# Altium schematic sheet main.SchDoc
size 420 x 297 mm
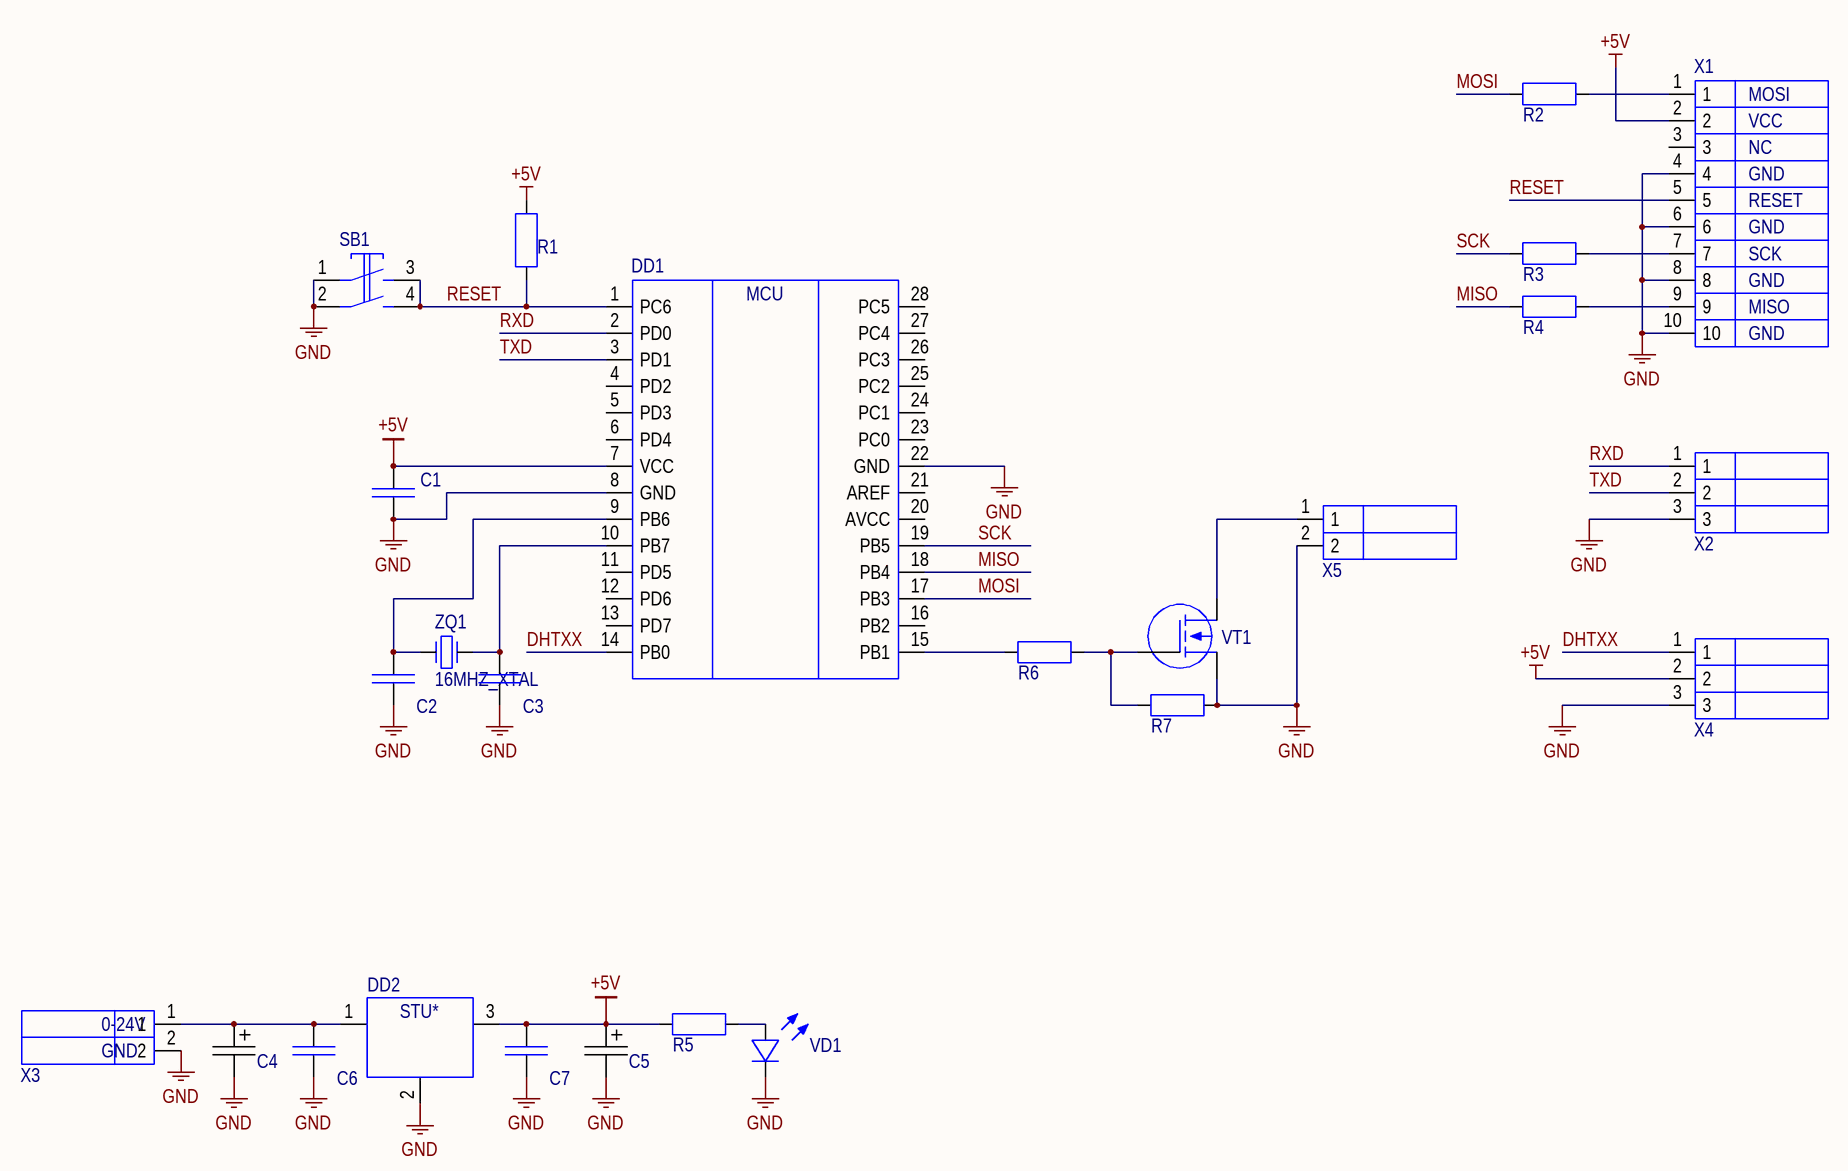
[diagram p0: main.SchDoc]

## Parts
C1  100P50V_CAPRR  [CAPRR500W50L400T260H400]  (value not drawn)
C2  30P50V_CAPRR  [CAPRR500W50L400T260H400]  (value not drawn)
C3  30P50V_CAPRR  [CAPRR500W50L400T260H400]  (value not drawn)
C4  100U16V_CAPAE  [CAPAE500X1100]  (value not drawn)
C5  47U16V_CAPAE  [CAPAE500X1100]  (value not drawn)
C6  100P50V_CAPRR  [CAPRR500W50L400T260H400]  (value not drawn)
C7  100P50V_CAPRR  [CAPRR500W50L400T260H400]  (value not drawn)
DD1  ATMEGA8  [PDIP28]  (value not drawn)
DD2  L7805ABV  [TO-220]  (value not drawn)
R1  CF14JT10K0  [RESAD800W55L600D230]  (value not drawn)
R2  CF14JT220R0  [RESAD800W55L600D230]  (value not drawn)
R3  CF14JT220R0  [RESAD800W55L600D230]  (value not drawn)
R4  CF14JT220R0  [RESAD800W55L600D230]  (value not drawn)
R5  CF14JT220R0  [RESAD800W55L600D230]  (value not drawn)
R6  CF14JT100R  [RESAD800W55L600D230]  (value not drawn)
R7  CF14JT10K0  [RESAD800W55L600D230]  (value not drawn)
SB1  BTN_TACTILE_6X6  [BTN_TACTILE_6X6]  (value not drawn)
VD1  LED_SSL-LX5093GD-TR26  [LED500]  (value not drawn)
VT1  IRF730  [TO-220-1]  (value not drawn)
X1  ISP  [302_SERIES_10POS]  (value not drawn)
X2  61300311121  [PLS_3]  (value not drawn)
X3  PJ-037BH  [PJ-037BH]  (value not drawn)
X4  61300311121  [PLS_3]  (value not drawn)
X5  SCREW3N2  [SCREW3N2]  (value not drawn)
ZQ1  16MHZ_XTAL  [XTAL1050X465X350]

## Nets
+5V: C1.2 C5.1 C7.2 DD1.7(VCC) DD2.3(OUT) R1.2 R5.2 X1.2 X4.2
GND: C1.1 C2.1 C3.1 C4.2 C5.2 C6.1 C7.1 DD1.8(GND) DD1.22(GND) DD2.2(GND) R7.2 SB1.1 SB1.2 VD1.K VT1.3 X1.4 X1.6 X1.8 X1.10 X2.3 X3.2 X4.3 X5.2
DHTXX: DD1.14(PB0) X4.1
MISO: DD1.18(PB4) R4.1
MOSI: DD1.17(PB3) R2.1
RESET: DD1.1(PC6) R1.1 SB1.3 SB1.4 X1.5
RXD: DD1.2(PD0) X2.1
SCK: DD1.19(PB5) R3.1
TXD: DD1.3(PD1) X2.2
NetC2_2: C2.2 DD1.9(PB6) ZQ1.2
NetC3_2: C3.2 DD1.10(PB7) ZQ1.1
NetC4_1: C4.1 C6.2 DD2.1(IN) X3.1
NetDD1_15: DD1.15(PB1) R6.1
NetR2_2: R2.2 X1.1
NetR3_2: R3.2 X1.7
NetR4_2: R4.2 X1.9
NetR5_1: R5.1 VD1.A
NetR6_2: R6.2 R7.1 VT1.1
NetVT1_2: VT1.2 X5.1

Not connected (* = marked no-connect by the designer): DD1 4(PD2) 5(PD3) 6(PD4) 11(PD5) 12(PD6) 13(PD7) 16(PB2) 20(AVCC) 21(AREF) 23(PC0) 24(PC1) 25(PC2) 26(PC3) 27(PC4) 28(PC5); X1 3

## Notes on the sheet
- Подп. и дата
- Инв. № дупл.
- Взам. инв. №
- Изм.
- Лист
- № докум.
- Подп.
- Дата
- Лит.
- Масса
- Масштаб
- Разраб.
- Пров.
- Т.контр.
- Листов
- Инв. № подп.
- Н.контр.
- Утв.
- (in symbol ATMEGA8) MCU
- (in symbol ISP) MOSI; VCC; NC; GND; RESET; SCK; MISO
- (in symbol L7805) STU*
- (in symbol PJ-037BH) 0-24V; GND

## Library data of the parts
C1 C6 C7 = 100P50V_CAPRR: CAP CER 100PF 50V C0G/NP0 RADIAL; Manufacturer: Vishay BCcomponents; Manufacturer Part Number: K101J10C0GF5UH5; Voltage: 50VDC; Capacitance: 100pF
C2 C3 = 30P50V_CAPRR: CAP CER 30PF 50V C0G/NP0 RADIAL; Manufacturer: Vishay BCcomponents; Manufacturer Part Number: K300J10C0GF5UH5; Capacitance: 100pF; Voltage: 50VDC
C4 = 100U16V_CAPAE: CAP ALUM 100UF 20% 16V RADIAL; Manufacturer: Panasonic; Manufacturer Part Number: ECA1CHG101; Capacitance: 47µF; Category: Capacitors
C5 = 47U16V_CAPAE: CAP ALUM 47UF 20% 16V RADIAL; Manufacturer: Panasonic; Manufacturer Part Number: ECA1CHG470; Capacitance: 47µF; Category: Capacitors
DD1 = ATMEGA8: LORA RADIO 868MHZ; Manufacturer: Microchip / Atmel; Manufacturer Part Number: ATMEGA8-16PU
DD2 = L7805: IC REG LINEAR 5V 1.5A TO220AB; Manufacturer: STMicroelectronics; Manufacturer Part Number: L7805ABV
R1 = 4.7K_AD800W55L600D230: RES 10K OHM 1/4W 5% AXIAL; Manufacturer: Stackpole Electronics; Power (Watts): 0.25W, 1/4W; Category: Resistors; Manufacturer Part Number: CF14JT10K0; Resistance (Ohms): 10k
R2-R5 = 220R_AD800W55L600D230: RES 220 OHM 1/4W 5% AXIAL; Manufacturer: Stackpole Electronics; Resistance (Ohms): 220; Power (Watts): 0.25W, 1/4W; Category: Resistors; Manufacturer Part Number: CF14JT220R0
R6 = 100R_AD800W55L600D230: RES 100 OHM 1/4W 5% AXIAL; Manufacturer: Stackpole Electronics; Resistance (Ohms): 100; Power (Watts): 0.25W, 1/4W; Category: Resistors; Manufacturer Part Number: CF14JT100R
R7 = 10K_AD800W55L600D230: RES 10K OHM 1/4W 5% AXIAL; Manufacturer: Stackpole Electronics; Power (Watts): 0.25W, 1/4W; Category: Resistors; Manufacturer Part Number: CF14JT10K0; Resistance (Ohms): 10k
SB1 = BTN_TACTILE_6X6: SWITCH TACTILE SPST-NO 0.05A 24V; Manufacturer: TE Connectivity Alcoswitch; Manufacturer Part Number: 1825910-6; Pole Throw Configuration: SPST
VD1 = LED_SSL-LX5093GD-TR26: LED GREEN DIFFUSED T-1 3/4 T/H; Manufacturer: Lumex; Manufacturer Part Number: SSL-LX5093GD-TR26
VT1 = IRF730: MOSFET N-CH 400V 5.5A TO-220; Manufacturer: STMicroelectronics; Manufacturer Part Number: IRF730
X1 = ISP: CONN HEADER VERT 10POS 2.54MM; ManufacturerPartNumber: 302-S101; Manufacturer: On-Shore Technology; Number of Positions: 10; Pitch: 0.100" (2.54mm); Manufacturer Part Number: 302-S101; Number of Rows: 2; Category: Connectors, Interconnects
X2 X4 = PLS_3: CONN HEADER VERT 8POS 2.54MM; Manufacturer: Wurth Electronics; Number of Contacts: 3; Pitch: 0.100" (2.54mm); Number of Rows: 1; Manufacturer Part Number: 61300311121; Category: Connectors, Interconnects; Number of Positions: 3
X3 = PJ-037BH: CONN PWR JACK 2.5X5.5MM SOLDER; Manufacturer: CUI; Manufacturer Part Number: PJ-037BH; Product Category: DC Power Connectors
ZQ1 = 16MHZ_XTAL: CRYSTAL 16.0000MHZ 20PF T/H; Manufacturer: ECS International; Manufacturer Part Number: ECS-160-20-4X; Frequency: 16 MHz; Load Capacitance: 20 pF; Category: Crystals